# EAGLE design CCProgrammer (EAGLE 7.2.0)
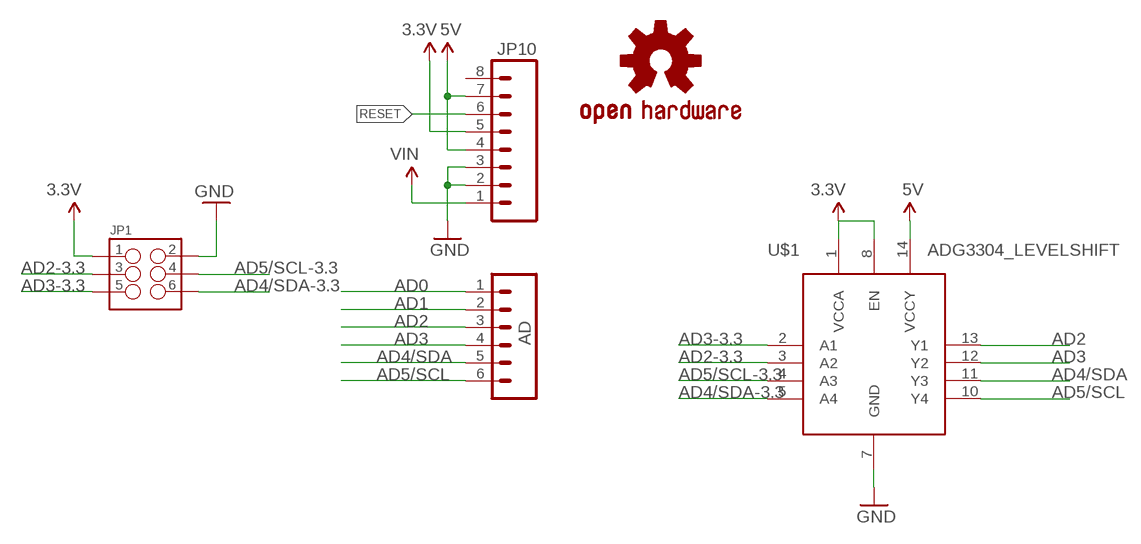
[diagram p0: schematic, sheet 1]

## Parts
AD  M06SMD-STRAIGHT-COMBO  [1X06_SMD_STRAIGHT_COMBO]
JP1  M03X2SHROUD  [2X3-SHROUDED]
JP10  M08SMD-COMBO  [1X08_SMD_COMBINED]
LOGO1  OSHW-LOGOM  [OSHW-LOGO-M]
U$1  ADG3304_LEVELSHIFT  [TSSOP14_0.65MM_4.4MM]

## Nets
3.3V: JP1.1 JP10.5 U$1.1(VCCA) U$1.8(EN)
5V: JP10.4 JP10.7 U$1.14(VCCY)
AD0: AD.1
AD1: AD.2
AD2: AD.3 U$1.13(Y1)
AD2-3.3: JP1.3 U$1.3(A2)
AD3: AD.4 U$1.12(Y2)
AD3-3.3: JP1.5 U$1.2(A1)
AD4/SDA: AD.5 U$1.11(Y3)
AD4/SDA-3.3: JP1.6 U$1.5(A4)
AD5/SCL: AD.6 U$1.10(Y4)
AD5/SCL-3.3: JP1.4 U$1.4(A3)
GND: JP1.2 JP10.2 JP10.3 U$1.7(GND)
RESET: JP10.6
VIN: JP10.1
Unconnected: JP10.8

## Library data of the parts
AD = SparkFun-Connectors:M06: Header 6 Standard 6-pin 0.1" header. Use with straight break away headers (SKU : PRT-00116), right angle break away headers (PRT-00553), swiss pins (PRT-00743), machine pins (PRT-00117), and female headers (PRT-00115). Molex polarized connector foot print use with SKU : PRT-08094 with associated crimp pins and housings. NOTES ON THE VARIANTS LOCK and LOCK_LONGPADS... This footprint was designed to help hold the alignment of a through-hole component (i.e. 6-pin header) while soldering it into place. You may notice that each hole has been shifted either up or down by 0.005 of an inch from it's more standard position (which is a perfectly straight line). This slight alteration caused the pins (the squares in the middle) to touch the edges of the holes. Because they are alternating, it causes a "brace" to hold the component in place. 0.005 has proven to be the perfect amount of "off-center" position when using our standard breakaway headers. Although looks a little odd when you look at the bare footprint, once you have a header in there, the alteration is very hard to notice. Also,if you push a header all the way into place, it is covered up entirely on the bottom side. This idea of altering the position of holes to aid alignment will be further integrated into the Sparkfun Library for other footprints. It can help hold any component with 3 or more connection pins.
JP1 = SparkFun-Connectors:M03X2: 2x3 .1" header. Shrouded, with keying- CONN-10681 SMT- CONN-11415 Pogo pins- HW-11044; PROD_ID: CONN-10681
JP10 = SparkFun-Connectors:M08: Header 8 Standard 8-pin 0.1" header. Use with straight break away headers (SKU : PRT-00116), right angle break away headers (PRT-00553), swiss pins (PRT-00743), machine pins (PRT-00117), and female headers (PRT-00115).
LOGO1 = SparkFun-Aesthetics:OSHW-LOGO: Open Source Hardware Logo This logo indicates the piece of hardware it is found on incorporates a OSHW license and/or adheres to the definition of open source hardware found here: http://freedomdefined.org/OSHW
U$1 = Terramus:ADG3304_LEVELSHIFT

## Net classes
0 default: width 0.152 mm, drill 0.305 mm, clearance 0.152 mm

## Board
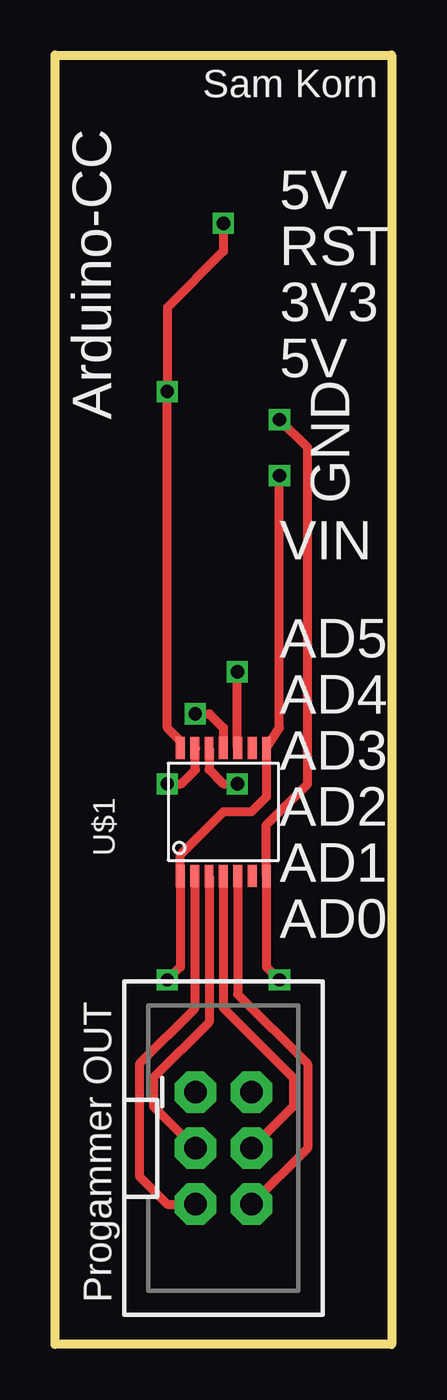
[diagram p1: board, top side]
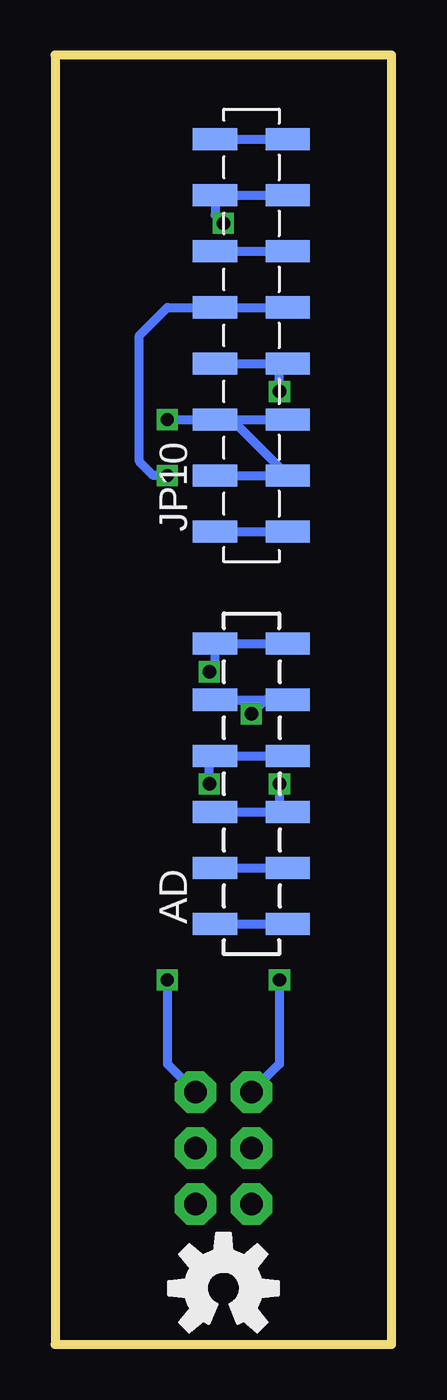
[diagram p2: board, bottom side, seen from below]

Size 15.24 x 58.42 mm. Coordinates in mm from the lower left corner, seen from the top.
Outline: 0,0 0,58.42 15.24,58.42 15.24,0 0,0
Copper layers (1*16): Top 0.0356mm / dielectric 1.5011mm / Bottom 0.0356mm
Design rules "LaenPCBOrder": minimum track width 6mil, minimum drill 13mil, track to track 6mil, track to pad 6mil, pad to pad 6mil, via to via 6mil, smd to smd 6mil, copper to edge 15mil, drill to drill 6mil, minimum pad ring 7mil, minimum via ring 7mil, stop-mask expansion 3mil, vias tented up to drill 0mil, thermal gap 10mil

### Footprints (pad centres in the part's own frame; a part is rotated, then mirrored left to right if it is on the bottom)
1X06_SMD_STRAIGHT_COMBO = smd 1 x 2: 1 0,-1.65; 1-2 0,1.65; 2 2.54,1.65; 2-2 2.54,-1.65; 3 5.08,-1.65; 3-2 5.08,1.65; 4 7.62,1.65; 4-2 7.62,-1.65; 5 10.16,-1.65; 5-2 10.16,1.65; 6 12.7,1.65; 6-2 12.7,-1.65
2X3-SHROUDED = drill 1.016 pad 1.88 octagon: 1 -1.27,2.54; 2 1.27,2.54; 3 -1.27,0; 4 1.27,0; 5 -1.27,-2.54; 6 1.27,-2.54
1X08_SMD_COMBINED = smd 1 x 2: 1 0,1.65; 1@2 0,-1.65; 2 2.54,-1.65; 2@2 2.54,1.65; 3 5.08,1.65; 3@2 5.08,-1.65; 4 7.62,-1.65; 4@2 7.62,1.65; 5 10.16,1.65; 5@2 10.16,-1.65; 6 12.7,-1.65; 6@2 12.7,1.65; 7 15.24,1.65; 7@2 15.24,-1.65; 8 17.78,-1.65; 8@2 17.78,1.65
TSSOP14_0.65MM_4.4MM = smd 0.4 x 1: 1 -1.95,-2.9; 2 -1.3,-2.9; 3 -0.65,-2.9; 4 0,-2.9; 5 0.65,-2.9; 6 1.3,-2.9; 7 1.95,-2.9; 8 1.95,2.9; 9 1.3,2.9; 10 0.65,2.9; 11 0,2.9; 12 -0.65,2.9; 13 -1.3,2.9; 14 -1.95,2.9

### Placement (x,y rotation side)
AD  6.35,19.05 90 bottom
JP1  7.62,8.89 0 top
JP10  6.35,36.83 90 bottom
LOGO1  7.62,2.54 0 bottom
U$1  7.62,24.13 0 top

### Tracks (layer width: path | path; a pad name or v marks a point on that pad's centre or on a via)
3.3V  (via drill 0.6)
  Top 0.406: v5.08,16.51 5.67,17.1 U$1.1 5.67,22.18 7.62,24.13 8.89,24.13 9.57,24.81 U$1.8 10.16,27.94 v10.16,39.37
  Bottom 0.406: v5.08,16.51 5.08,12.7 JP1.1 | JP10.5 10.16,46.99 11.43,45.72 11.43,40.01 10.8,39.37 v10.16,39.37
5V  (via drill 0.6)
  Top 0.406: U$1.14 5.67,27.35 5.08,27.94 v5.08,43.18 5.08,46.99 7.62,49.53 v7.62,50.8
  Bottom 0.406: v5.08,43.18 5.08,44.07 JP10.4 | JP10.7 8,51.18 v7.62,50.8
AD2  (via drill 0.6)
  Top 0.406: v5.08,25.4 5.71,25.4 6.35,26.04 6.35,27 U$1.13
  Bottom 0.406: v5.08,25.4 5.08,24.51 AD.3
AD2-3.3
  Top 0.406: U$1.3 6.97,14.59 4.45,12.06 4.45,10.79 JP1.3
AD3  (via drill 0.6)
  Top 0.406: U$1.12 6.97,26.05 7.62,25.4 v8.25,25.4
  Bottom 0.406: v8.25,25.4 8.25,26.41 AD.4
AD3-3.3
  Top 0.406: U$1.2 6.32,15.21 3.81,12.7 3.81,7.62 5.08,6.35 JP1.5
AD4/SDA  (via drill 0.6)
  Top 0.406: v6.35,28.57 6.99,28.57 7.62,27.94 U$1.11
  Bottom 0.406: AD.5 5.71,29.21 v6.35,28.57
AD4/SDA-3.3
  Top 0.406: U$1.5 8.27,15.86 11.43,12.7 11.43,8.89 JP1.6
AD5/SCL  (via drill 0.6)
  Top 0.406: U$1.10 8.25,27.05 v8.25,30.48
  Bottom 0.406: v8.25,30.48 8,30.73 AD.6
AD5/SCL-3.3
  Top 0.406: U$1.4 7.62,15.24 10.8,12.06 10.8,10.79 JP1.4
GND  (via drill 0.6)
  Top 0.406: v10.16,16.51 9.57,17.1 U$1.7 9.57,23.54 11.43,25.4 11.43,40.64 v10.16,41.91
  Bottom 0.406: JP10.2 7.24,41.91 JP10.3 v10.16,41.91 | v10.16,16.51 10.16,12.7 JP1.2

### Text on the board
tPlace: Sam Korn | 5V | RST | 3V3 | 5V | Arduino-CC | GND | VIN | AD5 | AD4 | AD3 | AD2 | AD1 | AD0 | Progammer OUT